# EAGLE board General IO (EAGLE 4.13), part 1 of 2
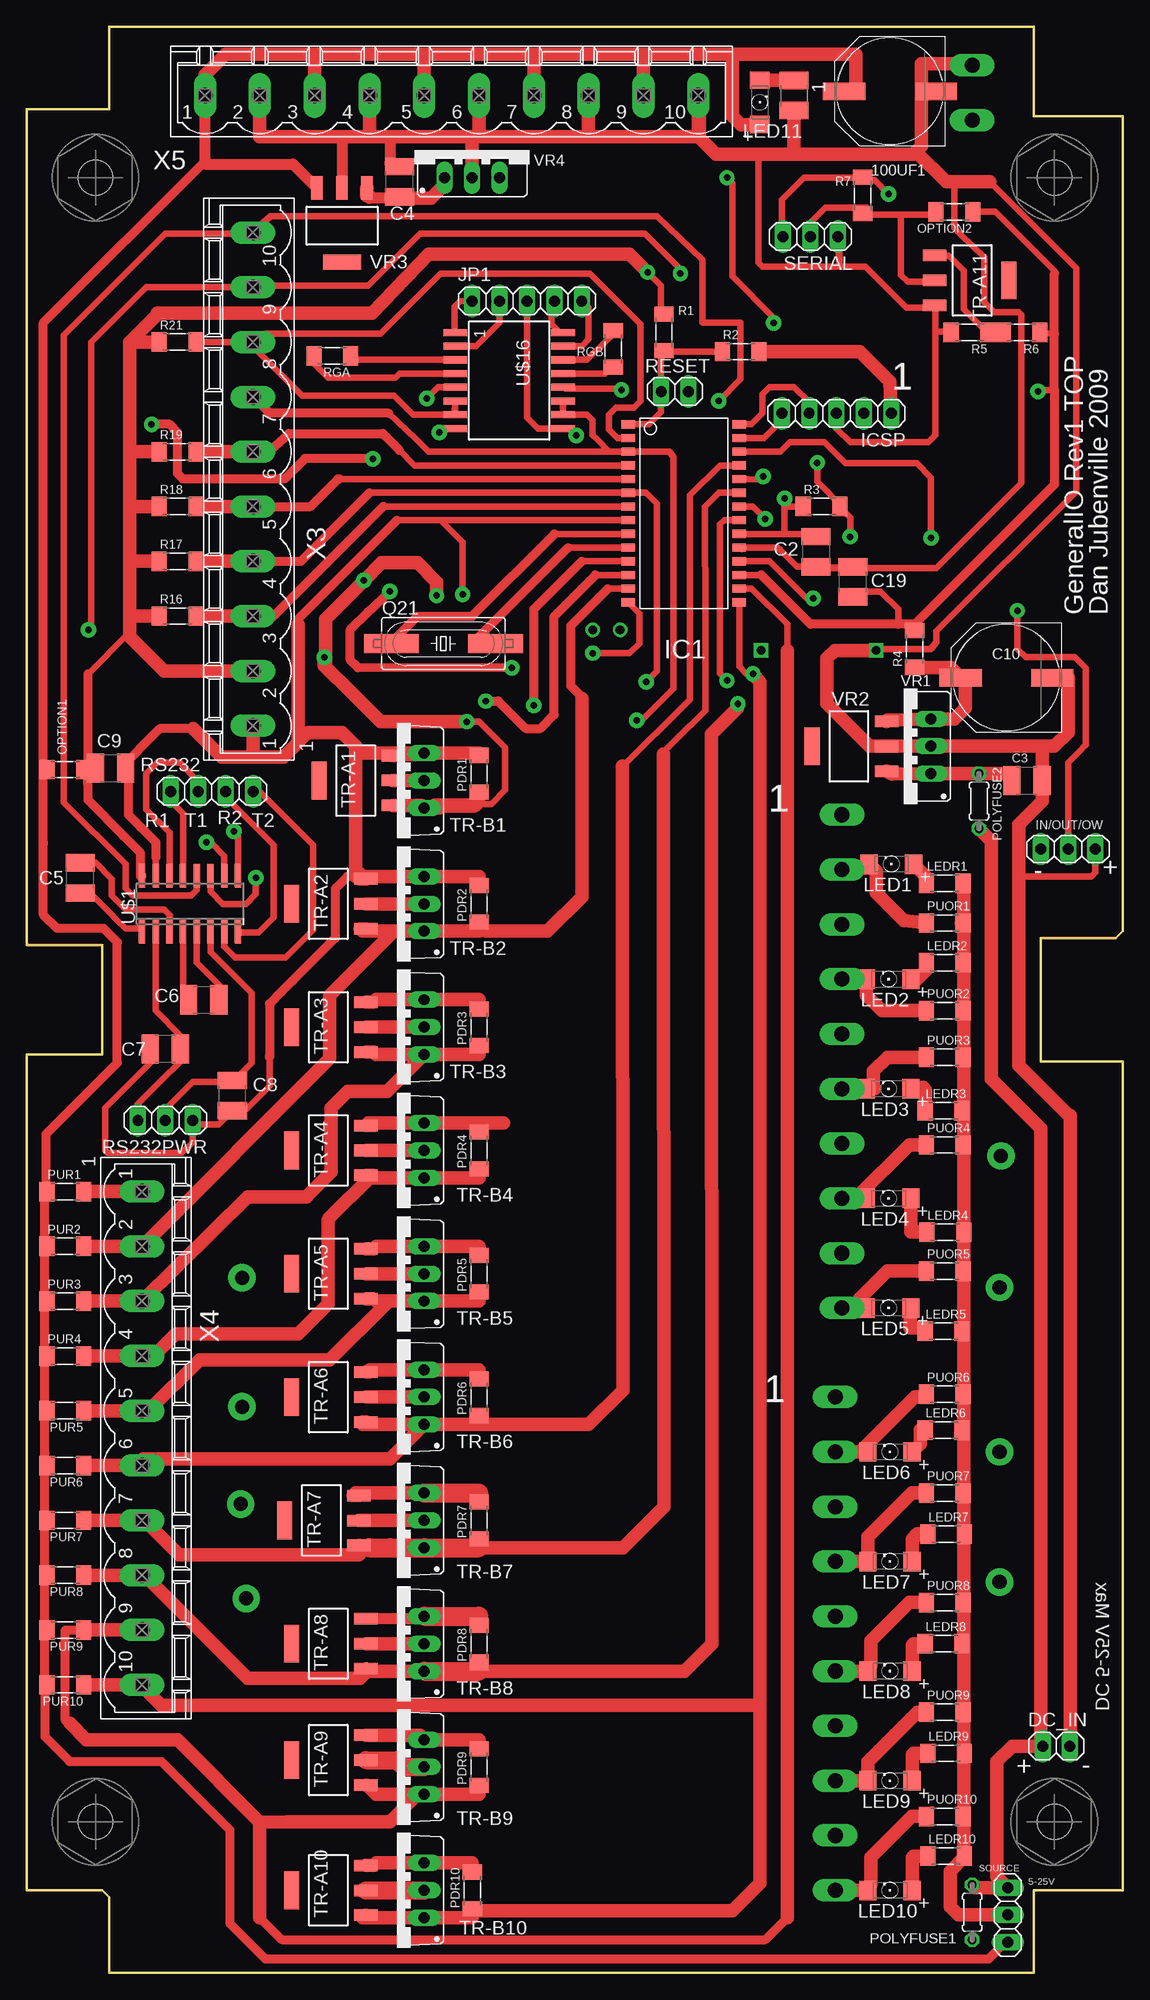
[diagram p1: board, top side]
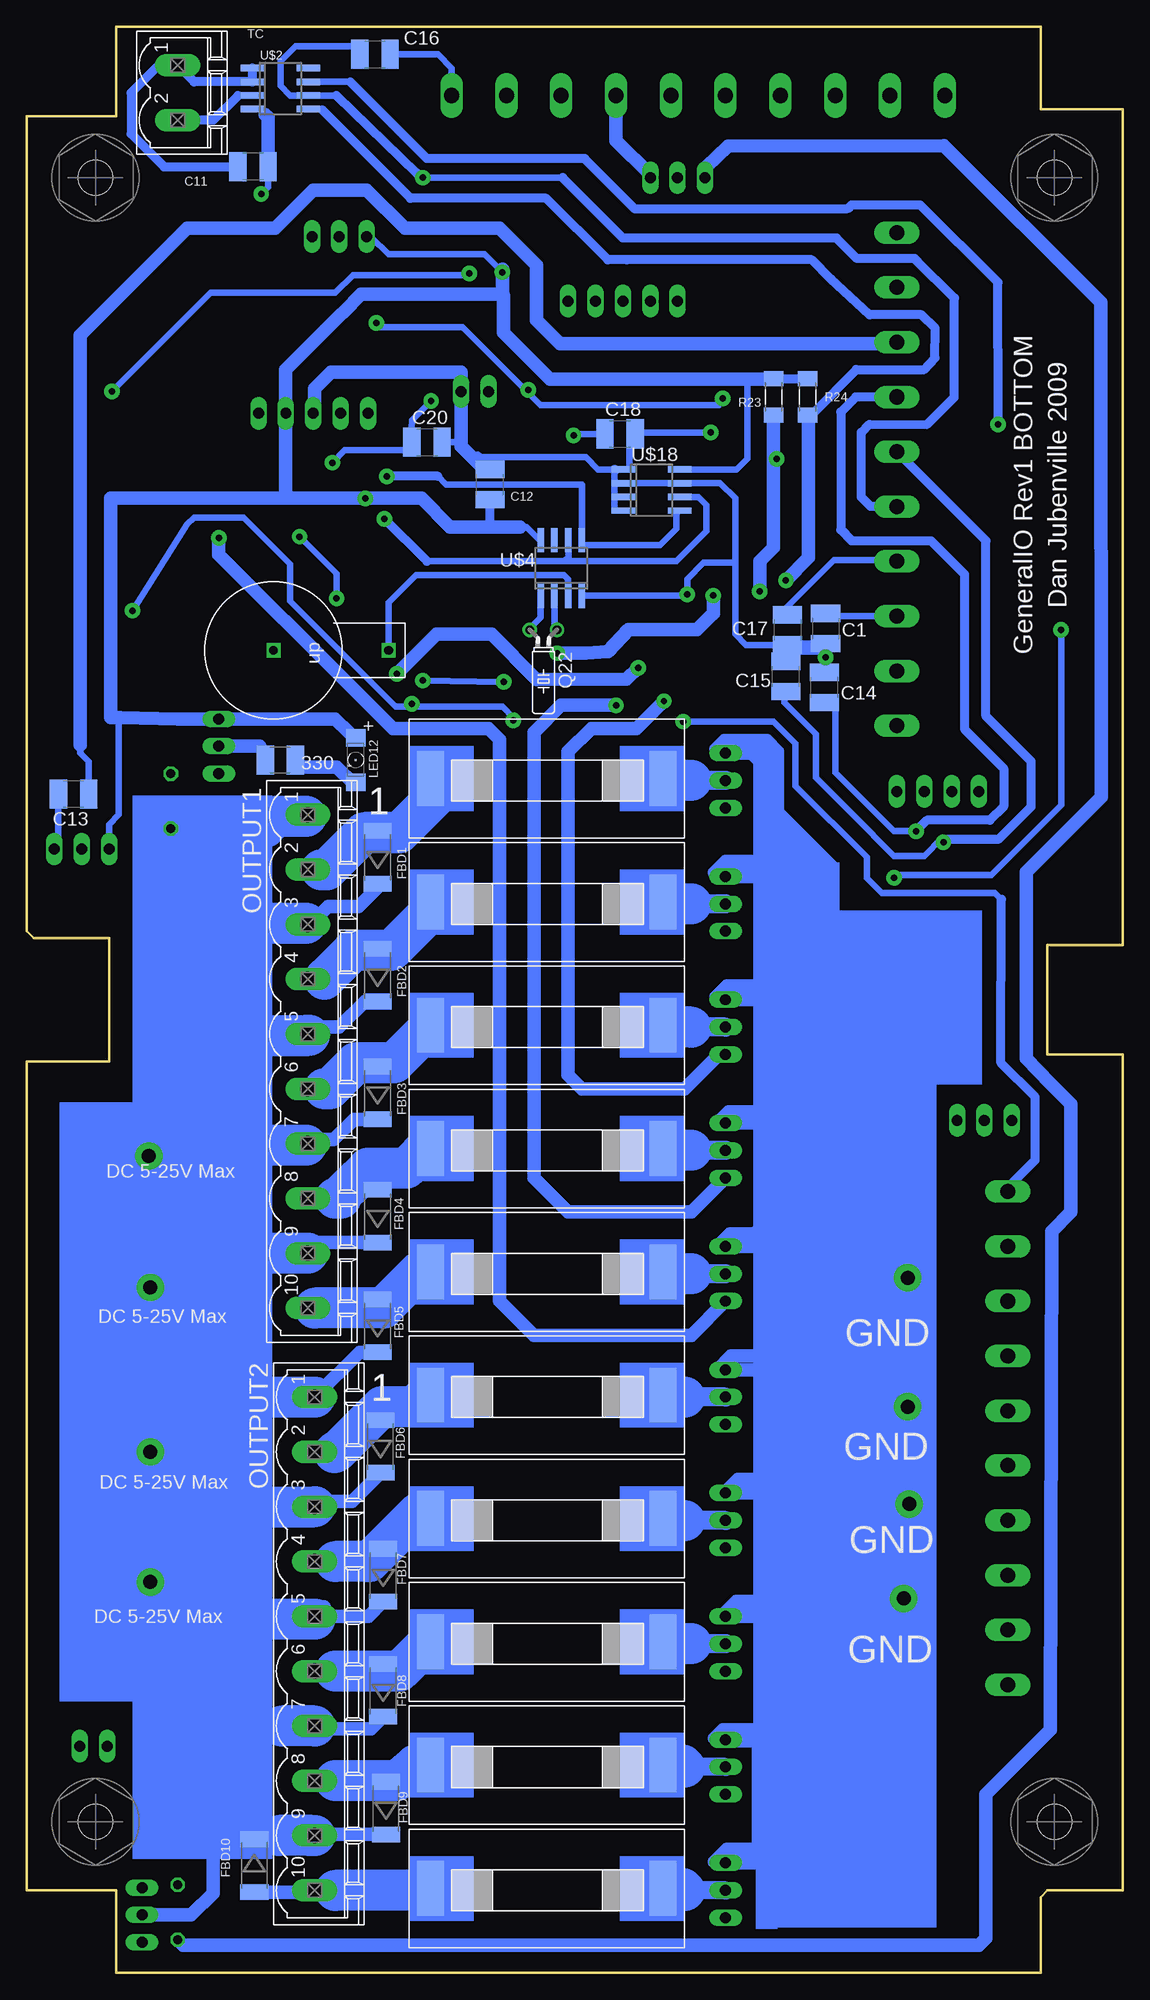
[diagram p2: board, bottom side, seen from below]

Size 101.6 x 180.34 mm. Coordinates in mm from the lower left corner, seen from the top.
Outline: 93.34,0 7.62,0 7.62,6.98 6.99,7.62 0,7.62 0,85.09 6.99,85.09 6.99,95.25 0,95.25 0,172.72 7.62,172.72 7.62,180.34 93.34,180.34 93.34,172.09 101.6,172.09 101.6,96.52 100.97,95.88 93.98,95.88 93.98,84.45 101.6,84.45 101.6,7.62 93.34,7.62 93.34,0
Copper layers (1*16): Top 0.035mm / dielectric 1.5mm / Bottom 0.035mm
Design rules "default": minimum track width 15mil, minimum drill 20mil, track to track 15mil, track to pad 15mil, pad to pad 15mil, via to via 15mil, smd to smd 0mil, copper to edge 15mil, drill to drill 15mil, minimum pad ring 10mil, minimum via ring 8mil, stop-mask expansion 4mil, vias tented up to drill 0mil, thermal gap 10mil

## Footprints (pad centres in the part's own frame; a part is rotated, then mirrored left to right if it is on the bottom)
R1210 = smd 1.6 x 2.7: 1 -1.4,0; 2 1.4,0
PANASONIC_G = smd 3.9 x 1.6: + 4.25,0; - -4.25,0
BH-401 = drill 0.8 square: P$1 0,0; P$2 0,10.668
C1210 = smd 1.6 x 2.7: 1 -1.4,0; 2 1.4,0
1X02 = drill 1.016 long: 1 -1.27,0; 2 1.27,0
SOD87 = smd 1.45 x 2.6: 1 -2.445,0; 2 2.445,0
FUSE = smd 2.54 x 5.08: P$1 2,5.54; P$2 23.54,5.54
SO-28W = smd 0.762 x 1.27: 1 -7.62,-5.207; 2 -6.35,-5.207; 3 -5.08,-5.207; 4 -3.81,-5.207; 5 -2.54,-5.207; 6 -1.27,-5.207; 7 0,-5.207; 8 1.27,-5.207; 9 2.54,-5.207; 10 3.81,-5.207; 11 5.08,-5.207; 12 6.35,-5.207; 13 7.62,-5.207; 14 8.89,-5.207; 15 8.89,5.08; 16 7.62,5.08; 17 6.35,5.08; 18 5.08,5.08; 19 3.81,5.08; 20 2.54,5.08; 21 1.27,5.08; 22 0,5.08; 23 -1.27,5.08; 24 -2.54,5.08; 25 -3.81,5.08; 26 -5.08,5.08; 27 -6.35,5.08; 28 -7.62,5.08
1X05 = drill 1.016 long: 1 -5.08,0; 2 -2.54,0; 3 0,0; 4 2.54,0; 5 5.08,0
1X03 = drill 1.016 long: 1 -2.54,0; 2 0,0; 3 2.54,0
1206 = smd 1.6 x 1.803: + -1.422,0; - 2.692,0
M1406 = smd 1.4 x 1.8: 1 -1.7,0; 2 1.7,0
MSTBV10 = drill 1.397 long: 1 -22.86,0; 2 -17.78,0; 3 -12.7,0; 4 -7.62,0; 5 -2.54,0; 6 2.54,0; 7 7.62,0; 8 12.7,0; 9 17.78,0; 10 22.86,0
0204/5 = drill 0.813 octagon: 1 -2.54,0; 2 2.54,0
SM49 = smd 5.08 x 1.778: 1 -4.826,0; 2 4.826,0
TC26H = drill 0.813 round: 1 -1.27,0; 2 1.27,0
1X04 = drill 1.016 long: 1 -3.81,0; 2 -1.27,0; 3 1.27,0; 4 3.81,0
MSTBV2 = drill 1.397 long: 1 -2.54,0; 2 2.54,0
SOT223R_INFINEON = smd 1.067 x 2.184: 1 -2.311,-3.479; 2 0,-3.48; 3 2.312,-3.48 | smd 3.5 x 1.4: 4 0,3.404
TO220BV = drill 1.016 long: D 0,-2.54; G -2.54,-2.54; S 2.54,-2.54
SO16 = smd 0.6 x 2.2: 1 -4.445,-2.6; 2 -3.175,-2.6; 3 -1.905,-2.6; 4 -0.635,-2.6; 5 0.635,-2.6; 6 1.905,-2.6; 7 3.175,-2.6; 8 4.445,-2.6; 9 4.445,2.6; 10 3.175,2.6; 11 1.905,2.6; 12 0.635,2.6; 13 -0.635,2.6; 14 -1.905,2.6; 15 -3.175,2.6; 16 -4.445,2.6
SO08 = smd 0.6 x 2.2: 1 -1.905,-2.6; 2 -0.635,-2.6; 3 0.635,-2.6; 4 1.905,-2.6; 5 1.905,2.6; 6 0.635,2.6; 7 -0.635,2.6; 8 -1.905,2.6
SCREW = hole 3.2: 0,0
MO004-16 = smd 0.65 x 2.2: 1 -4.445,-5; 2 -3.175,-5; 3 -1.905,-5; 4 -0.635,-5; 5 0.635,-5; 6 1.905,-5; 7 3.175,-5; 8 4.445,-5; 9 4.445,5; 10 3.175,5; 11 1.905,5; 12 0.635,5; 13 -0.635,5; 14 -1.905,5; 15 -3.175,5; 16 -4.445,5
TO220S = drill 1.016 long: 1 -2.54,-2.54; 2 0,-2.54; 3 2.54,-2.54

## Placement (x,y rotation side)
1  [R1210]  71.12,173.99 270 top
100UF1  Extra power  [PANASONIC_G]  80.01,174.37 180 top
330  [R1210]  78.11,112.39 180 bottom
BAT1  BH-401  [BH-401]  68.07,122.55 90 bottom
C1  .1uf  [C1210]  27.56,124.59 270 bottom
C2  .1uf PIC Bypass  [C1210]  73.15,131.7 270 top
C3  .1uf main  [C1210]  92.71,110.49 0 top
C4  .1uf Extra power  [C1210]  34.54,165.99 90 top
C5  1uf  [C1210]  4.95,101.47 90 top
C6  1uf  [C1210]  16.38,90.17 0 top
C7  1uf  [C1210]  12.83,85.6 180 top
C8  1uf  [C1210]  19.05,81.28 90 top
C9  1uf  [C1210]  7.75,111.63 0 top
C10  Main Power  [PANASONIC_G]  90.81,120.02 180 top
C11  .1uf TC Bypass  [C1210]  80.64,167.39 180 bottom
C12  .1uf Timer Bypass  [C1210]  58.67,137.92 90 bottom
C13  .1uf  [C1210]  97.28,109.22 180 bottom
C14  .1uf  [C1210]  27.69,119.13 90 bottom
C15  .1uf  [C1210]  31.24,120.14 90 bottom
C16  .1uf  [C1210]  69.34,177.8 0 bottom
C17  .1uf  [C1210]  31.11,124.46 270 bottom
C18  .1uf  [C1210]  46.61,142.62 0 bottom
C19  .1uf  [C1210]  76.58,128.91 90 top
C20  .1uf  [C1210]  64.52,141.86 0 bottom
DC_IN  [1X02]  95.43,20.98 0 top
FBD1  [SOD87]  69.09,103.38 90 bottom
FBD2  [SOD87]  69.09,92.46 90 bottom
FBD3  [SOD87]  69.09,81.53 90 bottom
FBD4  [SOD87]  69.09,70.1 90 bottom
FBD5  [SOD87]  69.09,59.94 90 bottom
FBD6  [SOD87]  68.83,48.77 90 bottom
FBD7  [SOD87]  68.58,36.83 90 bottom
FBD8  [SOD87]  68.58,26.16 90 bottom
FBD9  [SOD87]  68.33,15.24 90 bottom
FBD10  [SOD87]  80.52,9.91 270 bottom
FUSE1  FUSE(SM)  [FUSE]  40.64,116.2 180 bottom
FUSE2  FUSE(SM)  [FUSE]  40.64,104.77 180 bottom
FUSE3  FUSE(SM)  [FUSE]  40.64,93.34 180 bottom
FUSE4  FUSE(SM)  [FUSE]  40.64,81.91 180 bottom
FUSE5  FUSE(SM)  [FUSE]  40.64,70.48 180 bottom
FUSE6  FUSE(SM)  [FUSE]  40.64,59.05 180 bottom
FUSE7  FUSE(SM)  [FUSE]  40.64,47.62 180 bottom
FUSE8  FUSE(SM)  [FUSE]  40.64,36.2 180 bottom
FUSE9  FUSE(SM)  [FUSE]  40.64,24.77 180 bottom
FUSE10  FUSE(SM)  [FUSE]  40.64,13.33 180 bottom
IC1  PIC16F876ASO  [SO-28W]  60.96,135.89 270 top
ICSP  [1X05]  75.06,144.53 180 top
IN/OUT/OW  [1X03]  96.52,104.14 180 top
JP1  [1X05]  46.35,154.94 0 top
LED1  [1206]  80.77,102.74 180 top
LED2  [1206]  80.52,92.08 180 top
LED3  [1206]  80.52,81.91 180 top
LED4  [1206]  80.52,71.75 180 top
LED5  [1206]  80.52,61.6 180 top
LED6  [1206]  80.64,48.26 180 top
LED7  [1206]  80.64,38.1 180 top
LED8  [1206]  80.64,27.94 180 top
LED9  [1206]  80.64,17.78 180 top
LED10  [1206]  80.64,7.62 180 top
LED11  Extra Power  [1206]  67.94,172.72 90 top
LED12  Main power  [1206]  71.12,113.03 270 bottom
LEDR1  [M1406]  85.09,100.96 0 top
LEDR2  [M1406]  85.09,93.6 0 top
LEDR3  [M1406]  84.96,79.88 0 top
LEDR4  [M1406]  85.14,68.61 0 top
LEDR5  [M1406]  84.96,59.44 0 top
LEDR6  [M1406]  84.96,50.29 0 top
LEDR7  [M1406]  85.22,40.64 0 top
LEDR8  [M1406]  84.96,30.48 0 top
LEDR9  [M1406]  85.22,20.32 0 top
LEDR10  [M1406]  85.22,10.79 0 top
OPTION1  0  [M1406]  3.56,111.51 0 top
OPTION2  [M1406]  85.98,163.2 180 top
OUTPUT1  MSTBV10  [MSTBV10]  75.56,84.45 270 bottom
OUTPUT2  MSTBV10  [MSTBV10]  74.93,30.48 270 bottom
PDR1  [M1406]  41.91,111.12 90 top
PDR2  [M1406]  41.91,99.06 90 top
PDR3  [M1406]  41.91,87.63 90 top
PDR4  [M1406]  41.91,76.2 90 top
PDR5  [M1406]  41.91,64.77 90 top
PDR6  [M1406]  41.91,53.34 90 top
PDR7  [M1406]  41.91,41.91 90 top
PDR8  [M1406]  41.91,30.48 90 top
PDR9  [M1406]  41.91,19.05 90 top
PDR10  [M1406]  41.27,7.62 90 top
POLYFUSE1  Extra Power  [0204/5]  87.63,5.59 270 top
POLYFUSE2  Main power  [0204/5]  88.27,108.58 90 top
PUOR1  [M1406]  85.09,97.28 0 top
PUOR2  [M1406]  85.09,89.15 0 top
PUOR3  [M1406]  85.09,84.84 0 top
PUOR4  [M1406]  85.09,76.71 0 top
PUOR5  [M1406]  85.09,65.02 0 top
PUOR6  [M1406]  85.09,53.59 0 top
PUOR7  [M1406]  85.09,44.45 0 top
PUOR8  [M1406]  85.09,34.29 0 top
PUOR9  [M1406]  85.09,24.13 0 top
PUOR10  [M1406]  85.09,14.48 0 top
PUR1  [M1406]  3.56,72.39 0 top
PUR2  [M1406]  3.56,67.31 0 top
PUR3  [M1406]  3.56,62.23 0 top
PUR4  [M1406]  3.56,57.15 0 top
PUR5  [M1406]  3.56,52.07 180 top
PUR6  [M1406]  3.56,46.99 180 top
PUR7  [M1406]  3.56,41.91 180 top
PUR8  [M1406]  3.56,36.83 180 top
PUR9  [M1406]  3.56,31.75 180 top
PUR10  [M1406]  3.56,26.67 180 top
Q21  20MHz  [SM49]  38.61,123.19 0 top
Q22  32.768kHz  [TC26H]  53.72,124.46 180 bottom
R1  10k  [M1406]  59.05,152.02 90 top
R2  470  [M1406]  66.17,150.24 0 top
R3  [M1406]  73.66,135.89 0 top
R4  [M1406]  82.3,122.68 90 top
R5  220k  [M1406]  87.38,152.02 180 top
R6  100k  [M1406]  92.2,152.02 180 top
R7  47k  [M1406]  77.47,164.72 270 top
R16  [M1406]  13.97,125.73 0 top
R17  [M1406]  13.97,130.81 0 top
R18  [M1406]  13.97,135.89 0 top
R19  [M1406]  13.97,140.97 0 top
R21  [M1406]  13.97,151.13 0 top
R23  [M1406]  32.38,146.05 270 bottom
R24  [M1406]  29.21,146.05 270 bottom
RESET  [1X02]  60.07,146.56 180 top
RGA  [M1406]  28.32,149.86 180 top
RGB  [M1406]  54.36,150.5 90 top
RS232  [1X04]  17.14,109.47 180 top
RS232PWR  [1X03]  12.83,78.99 180 top
SERIAL  [1X03]  72.64,160.91 180 top
SOURCE  [1X03]  90.93,5.33 90 top
TC  Type K  [MSTBV2]  87.63,174.24 270 bottom
TR-A1  [SOT223R_INFINEON]  30.48,110.49 90 top
TR-A2  [SOT223R_INFINEON]  27.94,99.06 90 top
TR-A3  [SOT223R_INFINEON]  27.94,87.63 90 top
TR-A4  [SOT223R_INFINEON]  27.94,76.2 90 top
TR-A5  [SOT223R_INFINEON]  27.94,64.77 90 top
TR-A6  [SOT223R_INFINEON]  27.94,53.34 90 top
TR-A7  [SOT223R_INFINEON]  27.3,41.91 90 top
TR-A8  [SOT223R_INFINEON]  27.94,30.48 90 top
TR-A9  [SOT223R_INFINEON]  27.94,19.68 90 top
TR-A10  [SOT223R_INFINEON]  27.94,7.62 90 top
TR-A11  [SOT223R_INFINEON]  87.63,156.84 270 top
TR-B1  [TO220BV]  34.29,110.49 90 top
TR-B2  [TO220BV]  34.29,99.06 90 top
TR-B3  [TO220BV]  34.29,87.63 90 top
TR-B4  [TO220BV]  34.29,76.2 90 top
TR-B5  [TO220BV]  34.29,64.77 90 top
TR-B6  [TO220BV]  34.29,53.34 90 top
TR-B7  [TO220BV]  34.29,41.91 90 top
TR-B8  [TO220BV]  34.29,30.48 90 top
TR-B9  [TO220BV]  34.29,19.05 90 top
TR-B10  [TO220BV]  34.29,7.62 90 top
U$1  MAX232  [SO16]  15.11,99.06 0 top
U$2  MAX6674  [SO08]  78.11,174.62 270 bottom
U$4  M41T00TIMER-I2C  [SO08]  52.07,130.18 0 bottom
U$11  [SCREW]  6.35,13.97 0 top
U$13  [SCREW]  95.25,13.97 0 top
U$14  [SCREW]  95.25,166.37 0 top
U$15  [SCREW]  6.35,166.37 0 top
U$16  INA2128  [MO004-16]  44.7,147.57 270 top
U$18  FM24C256  [SO08]  43.69,137.41 270 bottom
VR1  Main  [TO220S]  81.28,113.66 90 top
VR2  Main  [SOT223R_INFINEON]  76.2,113.66 90 top
VR3  Extra power  [SOT223R_INFINEON]  29.21,161.93 180 top
VR4  Extra power  [TO220S]  41.27,168.91 0 top
X3  Inputs 1  [MSTBV10]  20.95,138.43 90 top
X4  Inputs 2  [MSTBV10]  10.67,49.53 270 top
X5  Extra power  [MSTBV10]  39.37,173.99 0 top